# EAGLE design PCB (EAGLE 9.6.2)
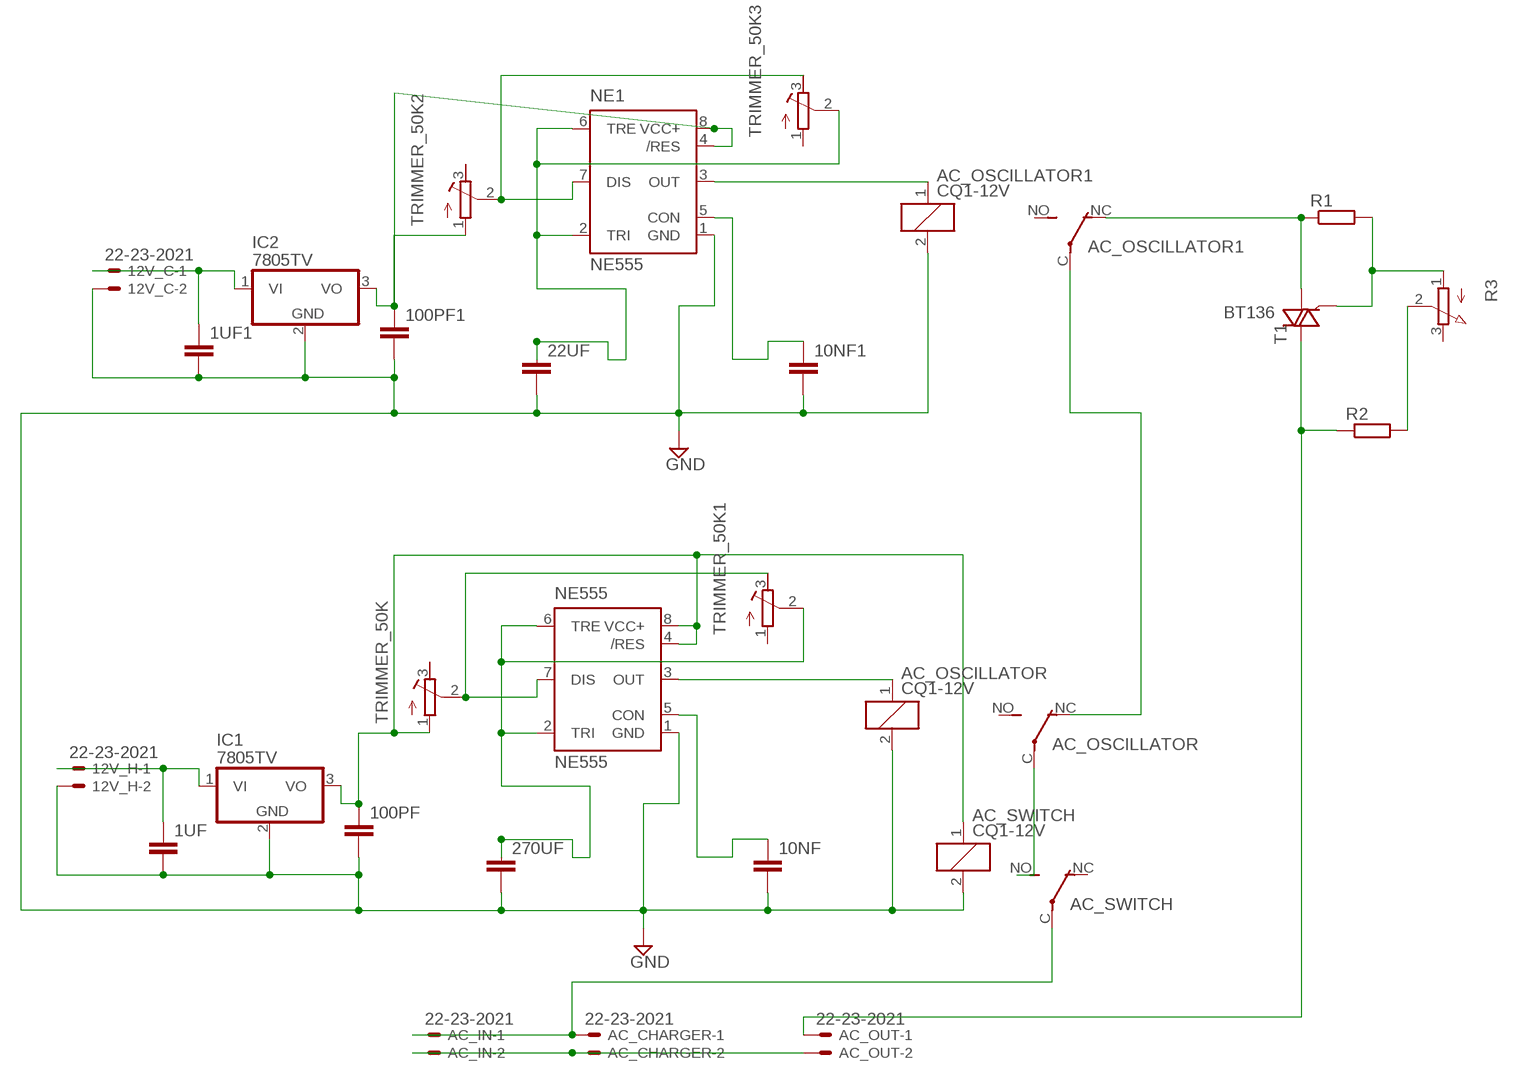
[diagram p0: schematic, sheet 1]

## Parts
1UF  C7.5/3  [C7.5B3]
1UF1  C7.5/3  [C7.5B3]
10NF  C7.5/3  [C7.5B3]
10NF1  C7.5/3  [C7.5B3]
12V_C  22-23-2021  [22-23-2021]
12V_H  22-23-2021  [22-23-2021]
22UF  C7.5/3  [C7.5B3]
100PF  C7.5/3  [C7.5B3]
100PF1  C7.5/3  [C7.5B3]
270UF  C7.5/3  [C7.5B3]
AC_CHARGER  22-23-2021  [22-23-2021]
AC_IN  22-23-2021  [22-23-2021]
AC_OSCILLATOR  CQ1-12V  [CQ1]
AC_OSCILLATOR1  CQ1-12V  [CQ1]
AC_OUT  22-23-2021  [22-23-2021]
AC_SWITCH  CQ1-12V  [CQ1]
IC1  7805TV  [TO220V]
IC2  7805TV  [TO220V]
NE1  NE555  [DIL-08]
NE555  NE555  [DIL-08]
R1  R-EU_0204/7  [0204/7]
R2  R-EU_0204/7  [0204/7]
R3  3RP/1610N  [3RP/1610N]
T1  BT136  [TO220AB]
TRIMMER_50K  R-TRIMM64W  [RTRIM64W]
TRIMMER_50K1  R-TRIMM64W  [RTRIM64W]
TRIMMER_50K2  R-TRIMM64W  [RTRIM64W]
TRIMMER_50K3  R-TRIMM64W  [RTRIM64W]

## Nets
GND: 1UF1.2 1UF.2 10NF1.2 10NF.2 12V_C.2 12V_H.2 22UF.2 100PF1.2 100PF.2 270UF.2 AC_OSCILLATOR1.2 AC_OSCILLATOR.2 AC_SWITCH.2 IC1.2(GND) IC2.2(GND) NE1.1(GND) NE555.1(GND)
N$1: AC_CHARGER.1 AC_IN.1 AC_SWITCH.C(2:P)
N$2: AC_CHARGER.2 AC_IN.2 AC_OUT.2
N$3: 10NF1.1 NE1.5(CON)
N$4: AC_OSCILLATOR.1 NE555.3(OUT)
N$5: 10NF.1 NE555.5(CON)
N$6: NE555.7(DIS) TRIMMER_50K1.3(E) TRIMMER_50K.2(S)
N$7: AC_OSCILLATOR.C(2:P) AC_SWITCH.NO(2:S)
N$8: AC_OSCILLATOR1.C(2:P) AC_OSCILLATOR.NC(2:O)
N$9: 1UF.1 12V_H.1 IC1.1(VI)
N$10: 270UF.1 NE555.2(TRI) NE555.6(TRE) TRIMMER_50K1.2(S)
N$11: R1.2 R3.1(A) T1.3(G)
N$12: AC_OSCILLATOR1.NC(2:O) R1.1 T1.1(A1)
N$13: 100PF.1 AC_SWITCH.1 IC1.3(VO) NE555.4(/RES) NE555.8(VCC+) TRIMMER_50K.1(A)
N$14: 22UF.1 NE1.2(TRI) NE1.6(TRE) TRIMMER_50K3.2(S)
N$15: NE1.7(DIS) TRIMMER_50K2.2(S) TRIMMER_50K3.3(E)
N$16: AC_OSCILLATOR1.1 NE1.3(OUT)
N$17: R2.2 R3.2(S)
N$18: 1UF1.1 12V_C.1 IC2.1(VI)
N$20: AC_OUT.1 R2.1 T1.2(A2)
N$21: 100PF1.1 IC2.3(VO) NE1.4(/RES) NE1.8(VCC+) TRIMMER_50K2.1(A)
Unconnected: AC_OSCILLATOR1.NO(2:S) AC_OSCILLATOR.NO(2:S) AC_SWITCH.NC(2:O) R3.3(E) TRIMMER_50K1.1(A) TRIMMER_50K2.3(E) TRIMMER_50K3.1(A) TRIMMER_50K.3(E)

## Library data of the parts
1UF 1UF1 10NF 10NF1 22UF 100PF 100PF1 270UF = capacitor-wima:C: CAPACITOR naming: grid - package width
12V_C 12V_H AC_CHARGER AC_IN AC_OUT = con-molex:22-23-2021: .100" (2.54mm) Center Header - 2 Pin; MF: MOLEX; MPN: 22-23-2021; OC_FARNELL: 1462926; OC_NEWARK: 25C3832
AC_OSCILLATOR AC_OSCILLATOR1 AC_SWITCH = relay:CQ1-12V: AUTOMOTIVE QUIET RELAY NAiS Source: http://www.mew-europe.com/.. en_ds_61208_0000.pdf; OC_FARNELL: unknown; OC_NEWARK: unknown
IC1 IC2 = linear:78*: Positive VOLTAGE REGULATOR Source: http://cache.national.com/ds/LM/LM78L05.pdf http://www.fairchildsemi.com/ds/LM/LM7805.pdf
NE1 NE555 = st-microelectronics:NE555: General purpose bipolar Timer; MF: Arrow Electronics; MPN: NE555N; OC_FARNELL: 1467742; OC_NEWARK: 89K1486
R1 R2 = rcl:R-EU_: RESISTOR, European symbol; SPICEPREFIX: R
R3 = pot:3RP/1610N: 16mm Potentiometer one level Source: http://www.alphapotentiometers.net/html/16mm_pot_2.html
T1 = triac:BT136: Triac BT136 series E sensitive gate Source: http://www.nxp.com/acrobat_download/datasheets/BT136_SERIES_E_2.pdf
TRIMMER_50K TRIMMER_50K1-TRIMMER_50K3 = rcl:R-TRIMM: Trimm resistor; SPICEMODEL: X; SPICEPREFIXL: POT

## Board
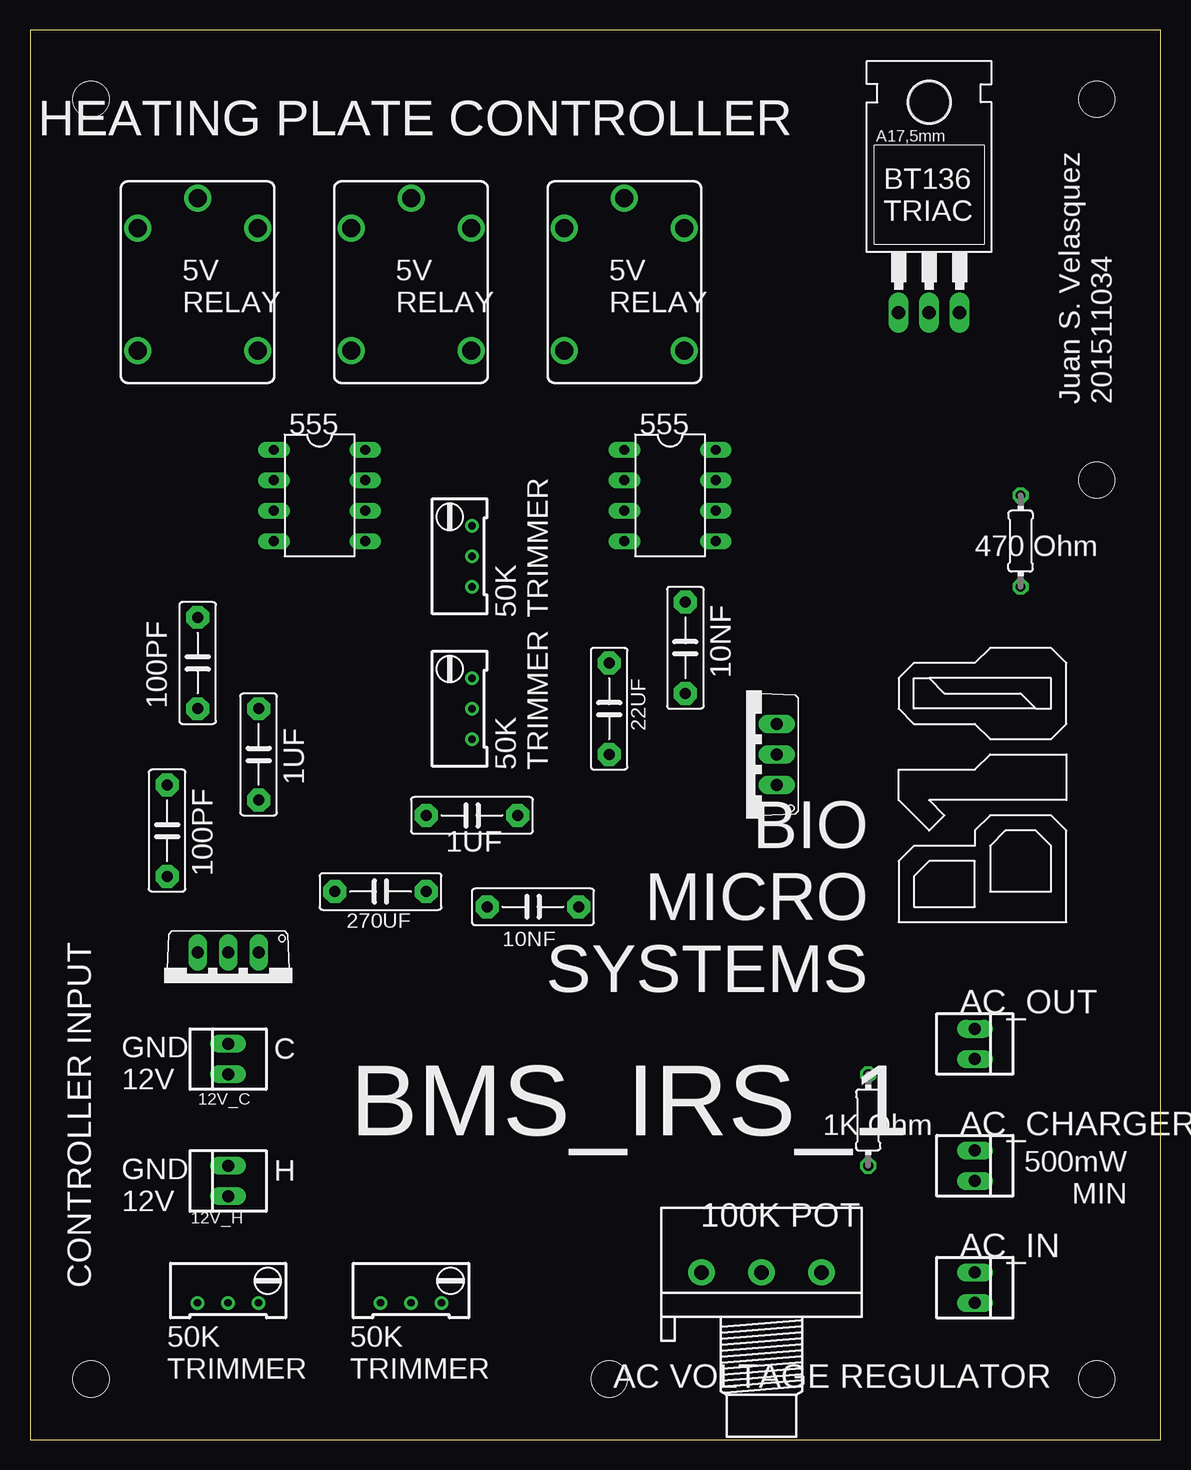
[diagram p1: board, top side]
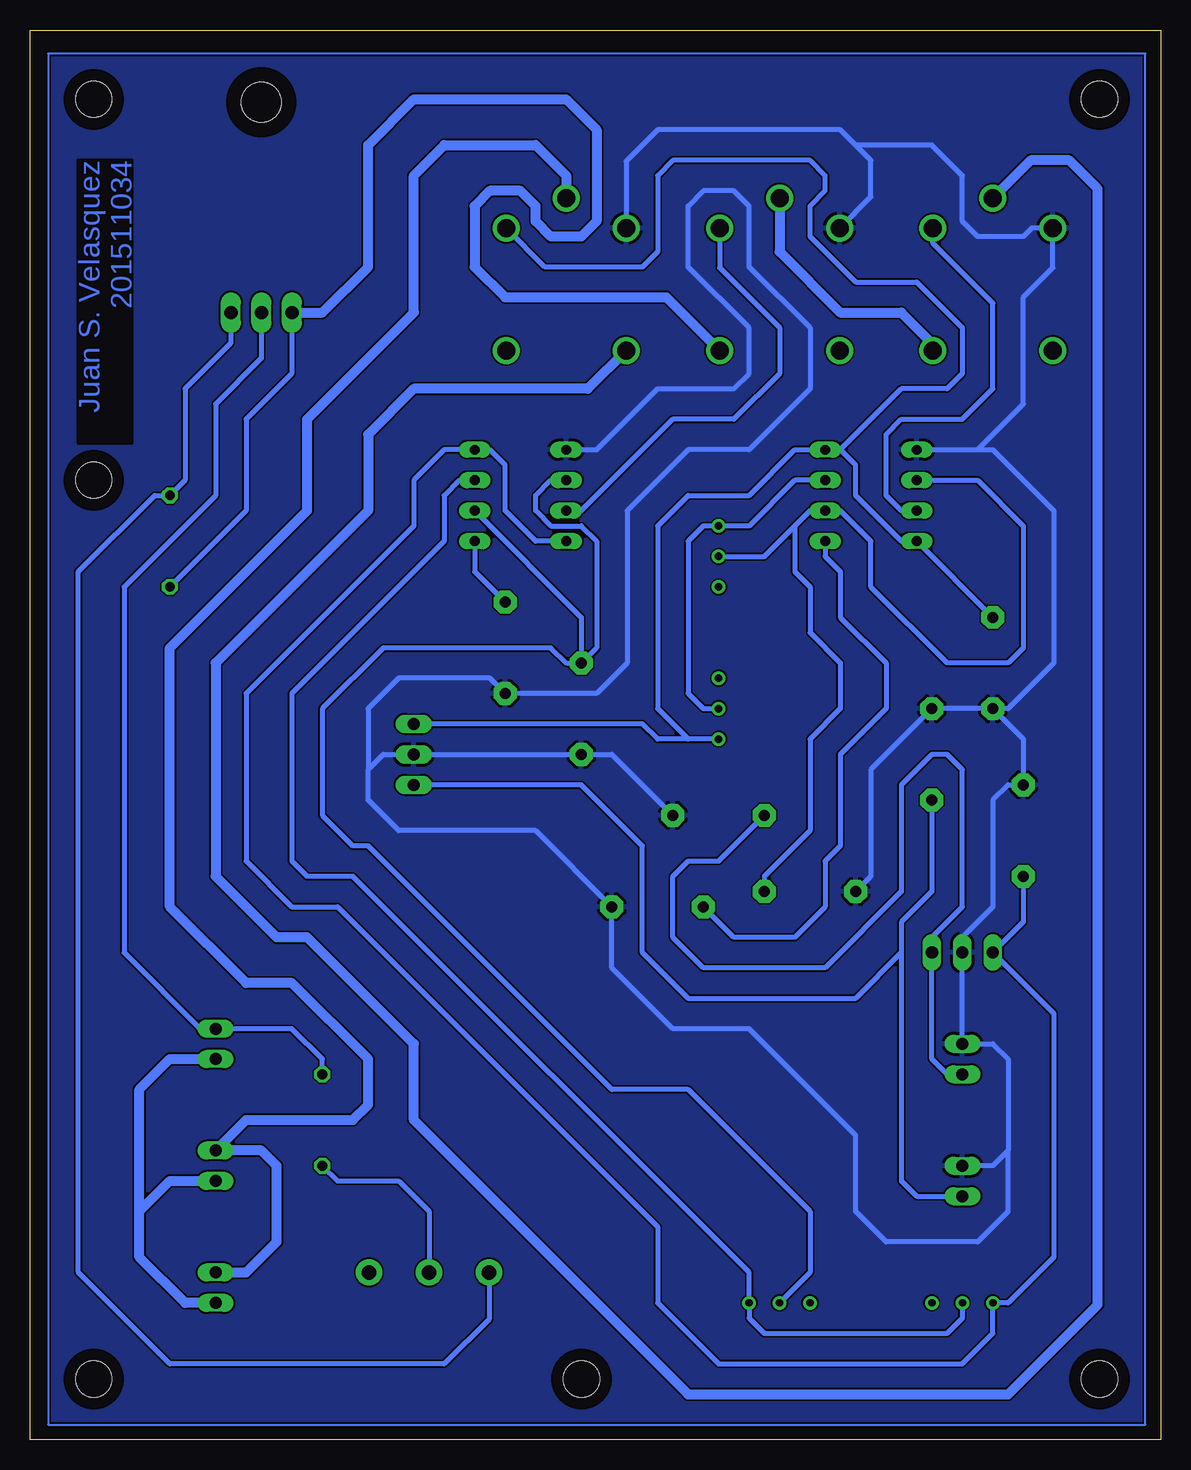
[diagram p2: board, bottom side, seen from below]

Size 94.21 x 117.54 mm. Coordinates in mm from the lower left corner, seen from the top.
Outline: 0,0 94.21,0 94.21,117.54 0,117.54 0,0
Copper layers (1*16): Top 0.035mm / dielectric 1.5mm / Bottom 0.035mm
Design rules "default": minimum track width 6mil, minimum drill 0.35mm, track to track 6mil, track to pad 6mil, pad to pad 6mil, via to via 6mil, smd to smd 6mil, copper to edge 40mil, drill to drill 6mil, minimum pad ring 10mil, minimum via ring 8mil, stop-mask expansion 4mil, vias tented up to drill 0mil, thermal gap 10mil
Holes 3 mm at 5.08,111.76 88.9,111.76 88.9,80.01 5.08,5.08 48.26,5.08 88.9,5.08

### Footprints (pad centres in the part's own frame; a part is rotated, then mirrored left to right if it is on the bottom)
C7.5B3 = drill 0.914 pad 1.905 octagon: 1 -3.81,0; 2 3.81,0
22-23-2021 = drill 1 long: 1 -1.27,0; 2 1.27,0
CQ1 = drill 1.5: 1 4.5,-5; 2 4.5,5; C 7,0; NC -5.7,-5; NO -5.7,5
TO220V = drill 1.016 long: 1 -2.54,-2.54; 2 0,-2.54; 3 2.54,-2.54
DIL-08 = drill 0.813 long: 1 -3.81,-3.81; 2 -1.27,-3.81; 3 1.27,-3.81; 4 3.81,-3.81; 5 3.81,3.81; 6 1.27,3.81; 7 -1.27,3.81; 8 -3.81,3.81
0204/7 = drill 0.813 octagon: 1 -3.81,0; 2 3.81,0
3RP/1610N = drill 1.2 pad 2.184: 1 -5,0; 2 0,0; 3 5,0
TO220AB = drill 1.118 long: 1 -2.54,-6.35; 2 0,-6.35; 3 2.54,-6.35 | hole 3.302: 0,11.176
RTRIM64W = drill 0.61: 1 1.27,-2.54; 2 1.27,0; 3 1.27,2.54

### Placement (x,y rotation side)
1UF  19.05,57.15 90 top
1UF1  36.83,52.07 0 top
10NF  41.91,44.45 0 top
10NF1  54.61,66.04 270 top
12V_C  16.51,31.75 90 top
12V_H  16.51,21.59 90 top
22UF  48.26,60.96 270 top
100PF  13.97,64.77 270 top
100PF1  11.43,50.8 90 top
270UF  29.21,45.72 180 top
AC_CHARGER  78.74,22.86 270 top
AC_IN  78.74,12.7 270 top
AC_OSCILLATOR  13.97,96.52 90 top
AC_OSCILLATOR1  31.75,96.52 90 top
AC_OUT  78.74,33.02 270 top
AC_SWITCH  49.53,96.52 90 top
IC1  59.69,57.15 90 top
IC2  16.51,38.1 180 top
NE1  53.34,78.74 270 top
NE555  24.13,78.74 270 top
R1  82.55,74.93 90 top
R2  69.85,26.67 270 top
R3  60.96,13.97 0 top
T1  74.93,100.33 0 top
TRIMMER_50K  35.56,60.96 0 top
TRIMMER_50K1  35.56,73.66 0 top
TRIMMER_50K2  16.51,12.7 270 top
TRIMMER_50K3  31.75,12.7 270 top

### Tracks (layer width: path | path; a pad name or v marks a point on that pad's centre or on a via)
GND
  Bottom 0.406: 100PF.2 1UF.2 24.13,55.88 24.13,46.99 270UF.2 | 100PF.2 11.43,58.42 100PF1.2 12.7,54.61 13.97,53.34 13.97,44.45 16.51,41.91 IC2.2 12V_C.2 13.97,33.02 12.7,31.75 12.7,24.13 | NE555.1 13.97,82.55 8.89,77.47 8.89,64.77 12.7,60.96 100PF.2 | 26.67,101.1 AC_OSCILLATOR1.2 24.13,103.64 24.13,106.68 25.4,107.95 | 12.7,24.13 13.97,22.86 12V_H.2 | AC_SWITCH.2 44.53,106.6 41.91,109.22 26.67,109.22 25.4,107.95 | 12.7,24.13 12.7,19.05 15.24,16.51 22.86,16.51 25.4,19.05 25.4,25.4 34.29,34.29 40.64,34.29 45.72,39.37 10NF.2 52.07,50.8 63.5,50.8 66.04,53.34 66.04,55.88 | 19.05,82.55 NE555.1 | 1UF1.2 45.72,57.15 22UF.2 IC1.2 64.77,57.15 66.04,55.88 | 66.04,55.88 66.04,60.96 63.5,63.5 55.88,63.5 10NF1.2 46.99,62.23 44.45,64.77 44.45,77.47 39.37,82.55 34.29,82.55 29.21,87.63 29.21,92.71 34.29,97.79 34.29,102.87 35.56,104.14 38.1,104.14 39.37,102.87 39.37,97.79 34.29,92.71 34.29,88.9 35.56,87.63 41.91,87.63 46.99,82.55 NE1.1 | NE555.1 15.24,82.55 11.43,86.36 11.43,95.25 8.97,97.71 AC_OSCILLATOR.2 10.74,101.02 11.43,100.33 15.24,100.33 16.51,101.6 16.51,105.41 19.05,107.95 25.4,107.95
  pour Bottom: 0,116.84 93.98,116.84 93.98,0 0,0
N$1
  Bottom 0.813: AC_IN.1 76.2,13.97 73.66,16.51 73.66,22.86 74.93,24.13 AC_CHARGER.1 76.2,26.67 67.31,26.67 66.04,27.94 66.04,31.75 72.39,38.1 76.2,38.1 82.55,44.45 82.55,66.04 71.12,77.47 71.12,85.09 62.23,93.98 62.23,105.41 59.69,107.95 52.07,107.95 49.53,105.41 AC_SWITCH.C
N$2
  Bottom 0.813: AC_IN.2 81.28,11.43 85.09,15.24 85.09,19.05 | 85.09,19.05 82.55,21.59 AC_CHARGER.2 | AC_OUT.2 82.55,31.75 85.09,29.21 85.09,19.05
N$3
  Bottom 0.406: NE1.5 57.15,72.39 10NF1.1
N$4
  Bottom 0.406: NE555.3 21.59,77.47 22.86,78.74 22.86,83.82 21.59,85.09 16.51,85.09 13.97,87.63 13.97,94.75 18.97,99.75 AC_OSCILLATOR.1
N$5
  Bottom 0.406: 10NF.1 35.56,41.91 30.48,41.91 27.94,44.45 27.94,48.26 26.67,49.53 26.67,57.15 22.86,60.96 22.86,64.77 26.67,68.58 26.67,72.39 27.94,73.66 NE555.5
N$6
  Bottom 0.406: NE555.7 30.48,80.01 34.29,76.2 TRIMMER_50K1.3 38.1,76.2 39.37,74.93 39.37,62.23 38.1,60.96 TRIMMER_50K.2
N$7
  Bottom 0.813: AC_SWITCH.NO 47.72,87.63 62.23,87.63 66.04,83.82 66.04,77.47 78.74,64.77 78.74,46.99 73.66,41.91 71.12,41.91 62.23,33.02 62.23,26.67 39.37,3.81 12.7,3.81 5.23,11.28 5.23,104.29 7.62,106.68 10.81,106.68 AC_OSCILLATOR.C
N$8
  Bottom 0.813: AC_OSCILLATOR1.C 31.75,99.06 26.67,93.98 21.59,93.98 18.97,91.36 AC_OSCILLATOR.NC
N$9
  Bottom 0.406: 12V_H.1 20.32,20.32 21.59,21.59 21.59,40.64 | 1UF.1 19.05,45.72 21.59,43.18 21.59,40.64 | IC1.1 48.26,54.61 43.18,49.53 43.18,40.64 39.37,36.83 25.4,36.83 21.59,40.64
N$10
  Bottom 0.406: NE555.2 15.24,80.01 11.43,76.2 11.43,66.04 12.7,64.77 17.78,64.77 24.13,71.12 24.13,74.93 26.67,77.47 NE555.6 29.21,77.47 30.48,76.2 | TRIMMER_50K1.2 33.02,73.66 30.48,76.2 | 30.48,76.2 30.48,72.39 29.21,71.12 29.21,67.31 26.67,64.77 26.67,60.96 29.21,58.42 29.21,50.8 33.02,46.99 270UF.1
N$11
  Bottom 0.406: T1.3 77.47,91.44 81.28,87.63 81.28,80.01 R1.2 83.82,78.74 90.17,72.39 90.17,13.97 82.55,6.35 59.69,6.35 55.96,10.08 R3.1
N$12
  Bottom 0.406: R1.1 76.2,77.47 76.2,85.09 72.39,88.9 T1.1
  Bottom 0.813: T1.1 69.85,93.98 66.04,97.79 66.04,107.95 62.23,111.76 49.53,111.76 46.99,109.22 46.99,101.6 48.26,100.33 50.8,100.33 52.07,101.6 52.07,102.87 53.34,104.14 55.88,104.14 57.15,102.87 57.15,97.79 54.61,95.25 41.18,95.25 AC_OSCILLATOR1.NC
N$13
  Bottom 0.406: 100PF.1 NE555.4 21.59,74.93 25.4,78.74 25.4,81.28 26.67,82.55 | 26.67,82.55 NE555.8 30.48,82.55 34.29,78.74 39.37,78.74 41.91,76.2 41.91,60.96 39.37,58.42 | AC_SWITCH.1 51.3,97.79 43.18,97.79 41.91,99.06 41.91,105.41 40.64,106.68 29.21,106.68 27.94,105.41 27.94,104.14 29.21,102.87 29.21,100.33 25.4,96.52 20.32,96.52 16.51,92.71 16.51,88.9 17.78,87.63 21.59,87.63 26.67,82.55 | TRIMMER_50K.1 39.37,58.42 | 39.37,58.42 41.91,58.42 43.18,59.69 IC1.3
N$14
  Bottom 0.406: 22UF.1 48.26,68.58 NE1.6 | NE1.2 50.8,80.01 52.07,78.74 52.07,77.47 50.8,76.2 48.26,76.2 46.99,74.93 46.99,66.04 22UF.1 | 22UF.1 49.53,64.77 50.8,66.04 64.77,66.04 69.85,60.96 69.85,52.07 67.31,49.53 66.04,49.53 45.72,29.21 39.37,29.21 29.21,19.05 29.21,13.97 TRIMMER_50K3.2
N$15
  Bottom 0.406: TRIMMER_50K2.2 16.51,10.16 17.78,8.89 33.02,8.89 34.29,10.16 TRIMMER_50K3.3 34.29,13.97 67.31,46.99 71.12,46.99 72.39,48.26 72.39,62.23 59.69,74.93 59.69,78.74 58.42,80.01 NE1.7
N$16
  Bottom 0.406: AC_OSCILLATOR1.1 36.75,97.71 31.75,92.71 31.75,88.9 35.56,85.09 40.64,85.09 48.26,77.47 NE1.3
N$17
  Bottom 0.406: R2.2 68.58,21.59 63.5,21.59 60.96,19.05 R3.2
N$18
  Bottom 0.406: 1UF1.1 36.83,48.26 39.37,48.26 40.64,46.99 40.64,41.91 38.1,39.37 27.94,39.37 21.59,45.72 21.59,54.61 19.05,57.15 17.78,57.15 16.51,55.88 16.51,44.45 19.05,41.91 IC2.1 19.05,31.75 17.78,30.48 12V_C.1
N$19
  Bottom 0.152: 1.27,115.57 92.71,115.57 92.71,1.27 1.27,1.27 1.27,115.57
N$20
  Bottom 0.406: T1.2 74.93,90.17 78.74,86.36 78.74,78.74 86.36,71.12 86.36,40.64 80.01,34.29 AC_OUT.1 72.39,34.29 69.85,31.75 R2.1
N$21
  Bottom 0.406: NE1.4 52.07,74.93 54.61,77.47 54.61,81.28 55.88,82.55 NE1.8 59.69,82.55 62.23,80.01 62.23,76.2 76.2,62.23 76.2,48.26 72.39,44.45 68.58,44.45 41.91,17.78 41.91,11.43 36.83,6.35 16.51,6.35 13.97,8.89 TRIMMER_50K2.1 12.7,11.43 8.89,15.24 8.89,35.56 IC2.3 11.43,43.18 100PF1.1

### Text on the board
Bottom: Juan S. Velasquez / 201511034
tPlace: HEATING PLATE CONTROLLER | BT136 / TRIAC | 5V / RELAY | 5V / RELAY | 5V / RELAY | Juan S. Velasquez / 201511034 | 555 | 555 | 470 Ohm | 50K / TRIMMER | 10NF | 100PF | 50K / TRIMMER | 1UF | BIO / MICRO / SYSTEMS | 1UF | 100PF | C | GND / 12V | BMS_IRS_1 | 1K Ohm | 500mW / MIN | H | GND / 12V | 100K POT | CONTROLLER INPUT | AC VOLTAGE REGULATOR | 50K / TRIMMER | 50K / TRIMMER